# Altium project coilcube_frontend_v2.PrjPcb
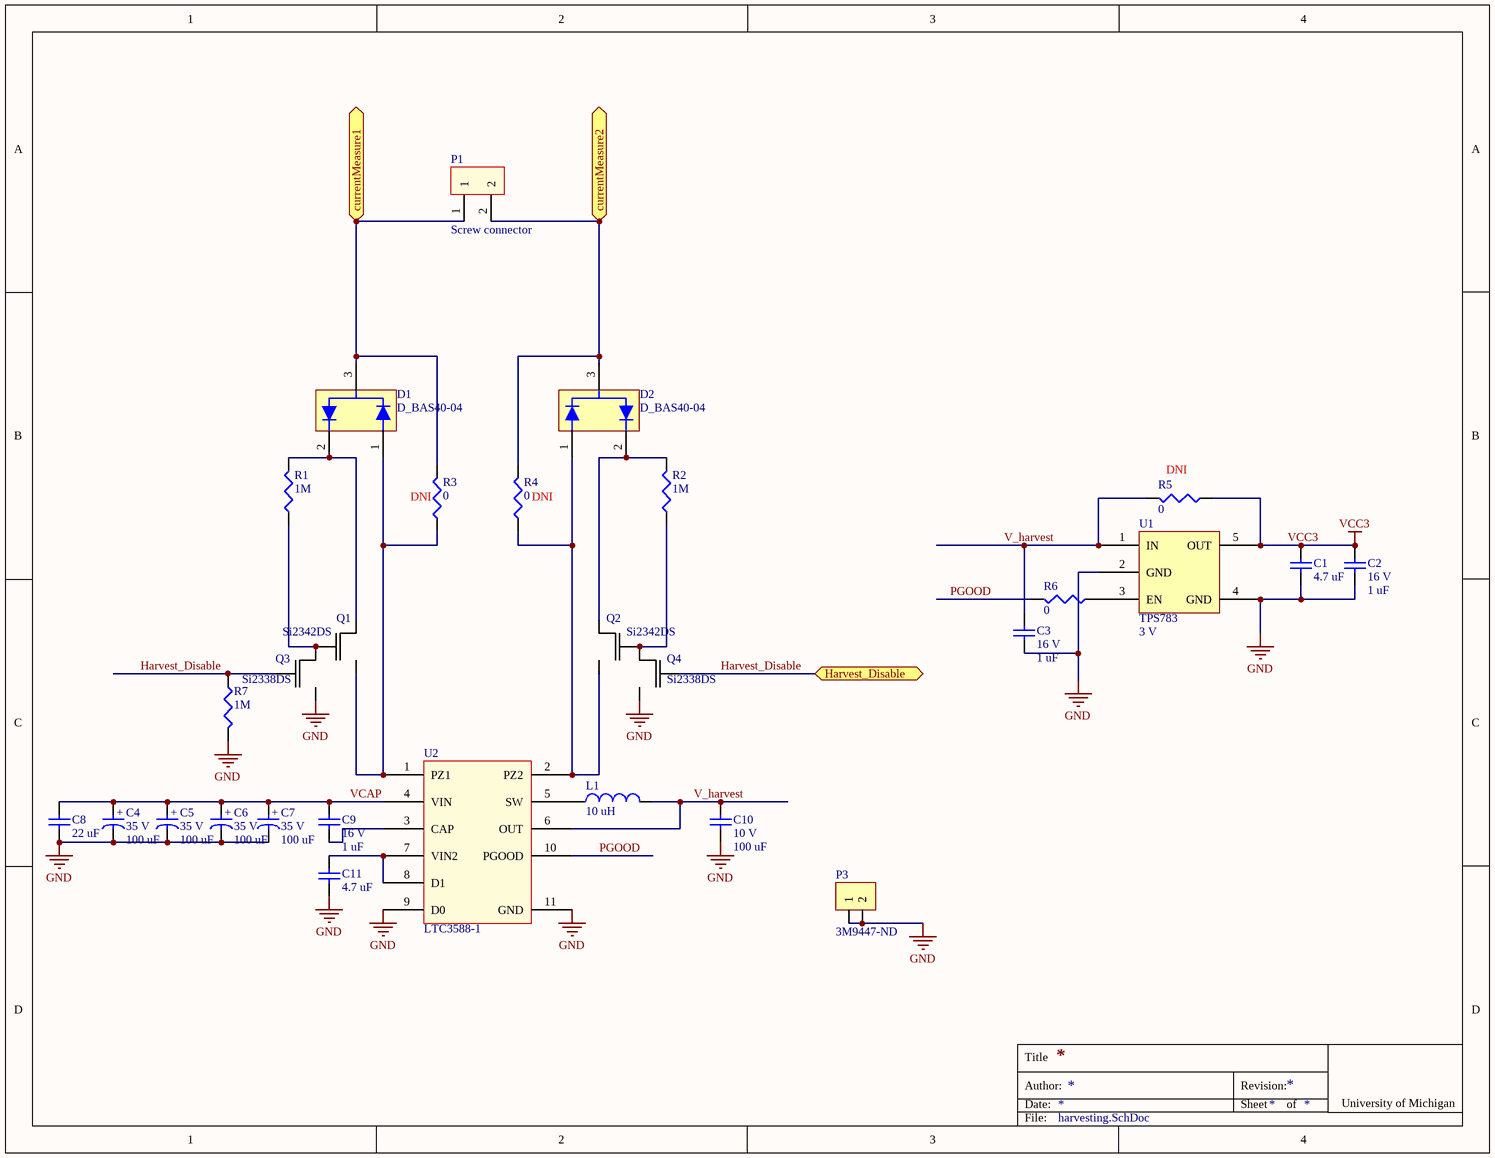
[diagram p0: harvesting.SchDoc]
3 sheets, 57 parts. Net scope: flat (ports and power ports of the same name join across sheets).
Board files: coilcube_frontend_v2.PcbDoc, coilcube_v5.PcbDoc
Sheets:
  harvesting.SchDoc
  IVSense.SchDoc
  proc.SchDoc

## Sheet harvesting.SchDoc
size Letter

### Parts
(Parts that share a designator on the sheet are numbered #1, #2 ... from top to bottom, then left to right.)
C1  value 4.7 uF  [0603]  (hidden comment: Ceramic capacitor)
C2  value 1 uF  voltage rated: 16 V  [0603]  (hidden comment: Ceramic capacitor)
C3  value 1 uF  voltage rated: 16 V  [0603]  (hidden comment: Ceramic capacitor)
C4  value 100 uF  voltage rated: 35 V  [KEMET_EDK_9H]  (hidden comment: Aluminum capacitor)
C5  value 100 uF  voltage rated: 35 V  [KEMET_EDK_9H]  (hidden comment: Aluminum capacitor)
C6  value 100 uF  voltage rated: 35 V  [KEMET_EDK_9H]  (hidden comment: Aluminum capacitor)
C7  value 100 uF  voltage rated: 35 V  [KEMET_EDK_9H]  (hidden comment: Aluminum capacitor)
C8  value 22 uF  [1206]  (hidden comment: Ceramic capacitor)
C9  value 1 uF  voltage rated: 16 V  [0603]  (hidden comment: Ceramic capacitor)
C10  value 100 uF  voltage rated: 10 V  [1210]  (hidden comment: Ceramic capacitor)
C11  value 4.7 uF  [0603]  (hidden comment: Ceramic capacitor)
D1  D_BAS40-04  [SOT23-3]
D2  D_BAS40-04  [SOT23-3]
L1  value 10 uH  [CDRH2D18]  (hidden comment: Chip inductor)
P1  Screw connector  [MPT_2position]
P3  Supplier Part Number 1: 3M9447-ND  [1x2 header]  (hidden comment: 1 x 2 header)
Q1#1  Si2342DS  [SOT23-3]
Q2#1  Si2342DS  [SOT23-3]
Q3  Si2338DS  [SOT23-3]
Q4  Si2338DS  [SOT23-3]
R1#1  value 1M  [0603]  (hidden comment: Chip resistor)
R2#1  value 1M  [0603]  (hidden comment: Chip resistor)
R3#1  value 0  [0603]  (hidden comment: Chip resistor)
R4#1  value 0  [0603]  (hidden comment: Chip resistor)
R5#1  value 0  [0603]  (hidden comment: Chip resistor)
R6#1  value 0  [0603]  (hidden comment: Chip resistor)
R7#1  value 1M  [0603]  (hidden comment: Chip resistor)
U1  TPS783  Output Voltage: 3 V  [SOT23-5]
U2  LTC3588-1  [TSSOP50P490X110_HS-11N]

### Ports
currentMeasure1, currentMeasure2, Harvest_Disable

### Nets
GND: C1.2 C2.2 C3.2 C4.2 C5.2 C6.2 C7.2 C8.2 C10.2 C11.2 P3.1 P3.2 Q3.2(S) Q4.2(S) R7#1.1 U1.2(GND) U1.4(GND) U2.9(D0) U2.11(GND)
VCC3: C1.1 C2.1 R5#1.2 U1.5(OUT)
Harvest_Disable: Q3.1(G) Q4.1(G) R7#1.2 ; port Harvest_Disable
PGOOD: R6#1.1 U2.10(PGOOD)
V_harvest: C3.1 C10.1 L1.1 R5#1.1 U1.1(IN) U2.6(OUT)
VCAP: C4.1 C5.1 C6.1 C7.1 C8.1 C9.1 U2.4(VIN)
NetC9_2: C9.2 U2.3(CAP)
NetC11_1: C11.1 U2.7(VIN2) U2.8(D1)
NetD1_1: D1.1 Q1#1.2(S) R3#1.2 U2.1(PZ1)
NetD1_2: D1.2 Q1#1.3(D) R1#1.1
NetD1_3: D1.3 P1.1 R3#1.1 ; port currentMeasure1
NetD2_1: D2.1 Q2#1.2(S) R4#1.2 U2.2(PZ2)
NetD2_2: D2.2 Q2#1.3(D) R2#1.1
NetD2_3: D2.3 P1.2 R4#1.1 ; port currentMeasure2
NetL1_2: L1.2 U2.5(SW)
NetQ1#1_1: Q1#1.1(G) Q3.3(D) R1#1.2
NetQ2#1_1: Q2#1.1(G) Q4.3(D) R2#1.2
NetR6#1_2: R6#1.2 U1.3(EN)

### Notes on the sheet
- (near R3#1) DNI
- (near R4#1) DNI
- (near R5#1) DNI
- Title
- Date:
- Author:
- Revision:
- Sheet
- of
- University of Michigan
- File:
- (in symbol C_100u_35V_aluminum) +

### Library data of the parts
C1 C11 = C_4.7u_10V_0603_ceramic: Ceramic capacitor, 4.7u, 10V, 0603 package; Manufacture: TDK; tolerance: 20%; Temp rating: X5R; package: 0603; voltage rated: 10 V; Supplier 1: Digi-Key; Supplier Part Number 1: 445-7482-1-ND
C2 C3 C9 = C_1u_16V_0603_ceramic: Ceramic capacitor, 1 uF, 16 V, 0603 package; Manufacture: TDK; tolerance: 10%; package: 0603; Supplier 1: Digi-Key; Supplier Part Number 1: 445-1604-1-ND
C4-C7 = C_100u_35V_aluminum: Aluminum capacitor, 100 uF, 35 V, KEMET EDK 9H; tolerance: 20%; Manufacture: Kemet; Supplier 1: Digi-Key; Supplier Part Number 1: 399-6671-1-ND
C8 = C_22u_35V_1206_ceramic: Ceramic capacitor, 22 uF, 35 V, 1206 package; Manufacture: TDK; voltage rated: 35 V; tolerance: 20%; package: 1206; Supplier 1: Digi-Key; Supplier Part Number 1: 445-8045-1-ND
C10 = C_100u_10V_1210_ceramic: Ceramic capacitor, 100u, 1210 package; Manufacture: Samsung; tolerance: 20%; package: 2917; Supplier 1: Digi-Key; Supplier Part Number 1: 1276-3364-1-ND
D1 D2 = D_BAS40-04: SURFACE MOUNT SCHOTTKY BARRIER DIODE; Supplier 1: Digi-Key; Supplier Part Number 1: BAS40-04FDICT-ND
L1 = L_10uH_1A_180m: Chip inductor, 10 uH,  1A, 180 mOhm; tolerance: 30%; Supplier 1: Digi-Key; Supplier Part Number 1: 308-1959-1-ND
P1 = MPT_2POS: Screw connector 2 positions; Supplier 1: Digi-Key; Supplier Part Number 1: 277-1273-ND
P3 = 1 x 2 header: 100 mils standard header; Supplier 1: Digi-Key
Q1#1 Q2#1 = Si2342DS: N-Channel 8 V (D-S) MOSFET; Supplier 1: Digi-Key; Supplier Part Number 1: SI2342DS-T1-GE3-ND
Q3 Q4 = Si2338DS: N-Channel 30 V (D-S) MOSFET; Supplier 1: Digi-Key; Supplier Part Number 1: SI2338DS-T1-GE3CT-ND
R1#1 R2#1 R7#1 = R_1M_0603: Chip resistor, 1 Meg, 0603 package; tolerance: 1%; power: 1/10 W; package: 0603; Supplier 1: Digi-Key; Supplier Part Number 1: 541-1.00MHCT-ND
R3#1 R4#1 R5#1 R6#1 = R_0_0603: Chip resistor, 0, 0603 package; package: 0603; Supplier 1: Digi-Key; Supplier Part Number 1: 541-0.0GCT-ND
U1 = TPS783: TPS783xx 500-nA IQ, 150-mA, Ultralow Quiescent Current  Low-Dropout Linear Regulator; Supplier 1: Digi-Key; Supplier Part Number 1: 296-25880-1-ND
U2 = LTC3588-1: Piezoelectric Energy   Harvesting Power Supply; Supplier 1: Digi-Key; Supplier Part Number 1: LTC3588EMSE-1#PBF-ND

## Sheet IVSense.SchDoc: Gemini++
size Letter; Author: Ye-Sheng Kuo; Revision: 7; SheetTotal: 4
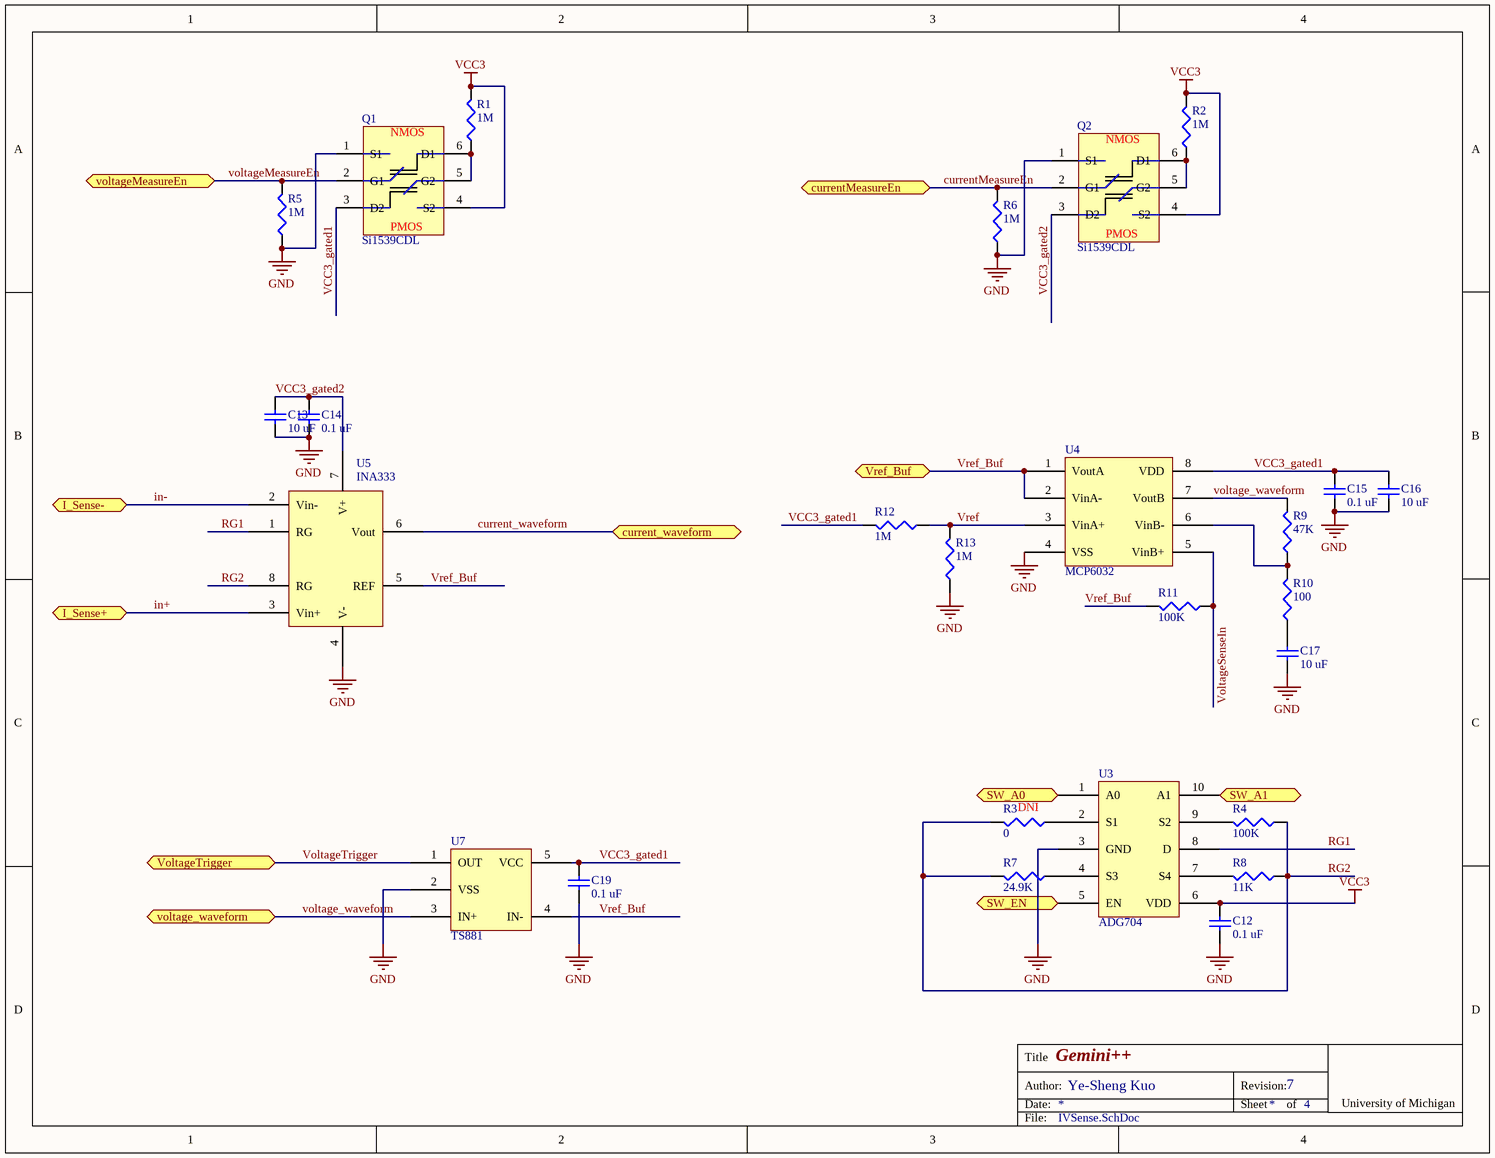
[diagram p1: IVSense.SchDoc]

### Parts
(Parts that share a designator on the sheet are numbered #1, #2 ... from top to bottom, then left to right.)
C12  value 0.1 uF  [0402]  (hidden comment: Ceramic capacitor)
C13  value 10 uF  [0603]  (hidden comment: Ceramic capacitor)
C14  value 0.1 uF  [0402]  (hidden comment: Ceramic capacitor)
C15  value 0.1 uF  [0402]  (hidden comment: Ceramic capacitor)
C16  value 10 uF  [0603]  (hidden comment: Ceramic capacitor)
C17  value 10 uF  [0603]  (hidden comment: Ceramic capacitor)
C19  value 0.1 uF  [0402]  (hidden comment: Ceramic capacitor)
Q1#2  Si1539CDL  [SC70-6]
Q2#2  Si1539CDL  [SC70-6]
R1#2  value 1M  [0402]  (hidden comment: Chip resistor)
R2#2  value 1M  [0402]  (hidden comment: Chip resistor)
R3#2  value 0  [0402]  (hidden comment: Chip resistor)
R4#2  value 100K  [0402]  (hidden comment: Chip resistor)
R5#2  value 1M  [0402]  (hidden comment: Chip resistor)
R6#2  value 1M  [0402]  (hidden comment: Chip resistor)
R7#2  value 24.9K  [0402]  (hidden comment: Chip resistor)
R8  value 11K  [0402]  (hidden comment: Chip resistor)
R9  value 47K  [0402]  (hidden comment: Chip resistor)
R10  value 100  [0402]  (hidden comment: Chip resistor)
R11  value 100K  [0402]  (hidden comment: Chip resistor)
R12  value 1M  [0402]  (hidden comment: Chip resistor)
R13  value 1M  [0402]  (hidden comment: Chip resistor)
U3  ADG704  [uSOIC-10]
U4  MCP6032  [MSOP-8]
U5  INA333  [MSOP-8]
U7#1  TS881  [SC70-5]

### Ports
current_waveform, currentMeasureEn, I_Sense+, I_Sense-, SW_A0, SW_A1, SW_EN, voltage_waveform, voltageMeasureEn, VoltageTrigger, Vref_Buf

### Nets
GND: C12.2 C13.2 C14.2 C15.2 C16.2 C17.2 C19.2 Q1#2.1(S1) Q2#2.1(S1) R5#2.2 R6#2.2 R13.2 U3.3(GND) U4.4(VSS) U5.4(V-) U7#1.2(VSS)
VCC3: C12.1 Q1#2.4(S2) Q2#2.4(S2) R1#2.1 R2#2.1 U3.6(VDD)
current_waveform: U5.6(Vout) ; port current_waveform
currentMeasureEn: Q2#2.2(G1) R6#2.1 ; port currentMeasureEn
in+: U5.3(Vin+) ; port I_Sense+
in-: U5.2(Vin-) ; port I_Sense-
RG1: U3.8(D) U5.1(RG)
RG2: R3#2.1 R4#2.2 R7#2.1 R8.2 U5.8(RG)
VCC3_gated1: C15.1 C16.1 C19.1 Q1#2.3(D2) R12.1 U4.8(VDD) U7#1.5(VCC)
VCC3_gated2: C13.1 C14.1 Q2#2.3(D2) U5.7(V+)
voltage_waveform: R9.1 U4.7(VoutB) U7#1.3(IN+) ; port voltage_waveform
voltageMeasureEn: Q1#2.2(G1) R5#2.1 ; port voltageMeasureEn
VoltageSenseIn: R11.2 U4.5(VinB+)
VoltageTrigger: U7#1.1(OUT) ; port VoltageTrigger
Vref: R12.2 R13.1 U4.3(VinA+)
Vref_Buf: R11.1 U4.1(VoutA) U4.2(VinA-) U5.5(REF) U7#1.4(IN-) ; port Vref_Buf
NetC17_1: C17.1 R10.2
NetQ1#2_5: Q1#2.5(G2) Q1#2.6(D1) R1#2.2
NetQ2#2_5: Q2#2.5(G2) Q2#2.6(D1) R2#2.2
NetR3#2_2: R3#2.2 U3.2(S1)
NetR4#2_1: R4#2.1 U3.9(S2)
NetR7#2_2: R7#2.2 U3.4(S3)
NetR8_1: R8.1 U3.7(S4)
NetR9_2: R9.2 R10.1 U4.6(VinB-)
NetU3_1: U3.1(A0) ; port SW_A0
NetU3_5: U3.5(EN) ; port SW_EN
NetU3_10: U3.10(A1) ; port SW_A1

### Notes on the sheet
- (near R3#2) DNI
- Title
- Date:
- Author:
- Revision:
- Sheet
- of
- University of Michigan
- File:
- (in symbol Si1539CDL) NMOS; PMOS

### Library data of the parts
C12 C14 C15 C19 = C_0.1u_10V_0402_ceramic: Ceramic capacitor, 0.1u, 0402 package; Manufacture: TDK; voltage rated: 10 V; tolerance: 10%; Supplier 1: Digi-Key; Supplier Part Number 1: 445-1265-1-ND; package: 0402
C13 C16 C17 = C_10u_6.3V_0603_ceramic: Ceramic capacitor, 10 uF, 0603 package; Manufacture: TDK; voltage rated: 6.3V; tolerance: 20%; package: 0603; Supplier 1: Digi-Key; Supplier Part Number 1: 445-4112-1-ND
Q1#2 Q2#2 = Si1539CDL: N- and P-Channel 30 V (D-S) MOSFET; Supplier 1: Digi-Key; Supplier Part Number 1: SI1539CDL-T1-GE3CT-ND
R1#2 R2#2 R5#2 R6#2 R12 R13 = R_1M_0402: Chip resistor, 1M, 0402 package; tolerance: 1%; power: 1/16 W; Supplier 1: Digi-Key; Supplier Part Number 1: 541-1.00MLCT-ND; package: 0402
R3#2 = R_0_0402: Chip resistor, 0, 0402 package; package: 0402; Supplier 1: Digi-Key; Supplier Part Number 1: 541-0.0YBCT-ND
R4#2 R11 = R_100K_0402: Chip resistor, 100K, 0402 package; tolerance: 1%; power: 1/16 W; Supplier 1: Digi-Key; Supplier Part Number 1: 541-100KLCT-ND; package: 0402
R7#2 = R_24.9K_0402: Chip resistor, 24.9K, 0402 package; tolerance: 1%; power: 1/16 W; package: 0402; Supplier 1: Digi-Key; Supplier Part Number 1: 541-24.9KLCT-ND
R8 = R_11K_0402: Chip resistor, 11K, 0603 package; tolerance: 1%; power: 1/16 W; package: 0402; Supplier 1: Digi-Key; Supplier Part Number 1: 541-11.0KLCT-ND
R9 = R_47K_0402: Chip resistor, 47K, 0402 package; tolerance: 1%; power: 1/16 W; package: 0402; Supplier 1: Digi-Key; Supplier Part Number 1: 541-47.0KLCT-ND
R10 = R_100_0402: Chip resistor, 100, 0402 package; tolerance: 1%; power: 1/16 W; package: 0402; Supplier 1: Digi-Key; Supplier Part Number 1: 541-100LCT-ND
U3 = ADG704: CMOS  Low Voltage 4 V, 4-Channel Multiplexer; Supplier 1: Digi-Key; Supplier Part Number 1: ADG704BRMZ-REELCT-ND
U4 = MCP6032: 0.9 µA, High Precision Op Amps; Supplier 1: Digi-Key; Supplier Part Number 1: MCP6032T-E/MSCT-ND
U5 = INA333: Micro-Power (50µA), Zerø-Drift, Rail-to-Rail Out  Instrumentation Amplifier; Supplier 1: Digi-Key; Supplier Part Number 1: 296-23564-1-ND
U7#1 = TS881: Rail-to-rail 0.9 V nanopower comparator; Supplier 1: Digi-Key; Supplier Part Number 1: 497-13217-1-ND

## Sheet proc.SchDoc
size Letter
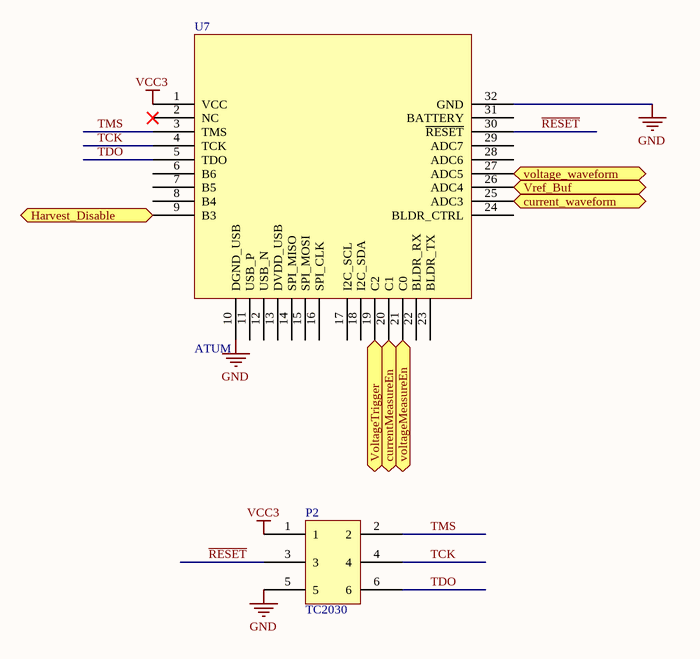
[diagram p2: proc.SchDoc]

### Parts
(Parts that share a designator on the sheet are numbered #1, #2 ... from top to bottom, then left to right.)
P2  TC2030  [TC2030-IDC-NLFP]
U7#2  ATUM  [ATUM]

### Ports
current_waveform, currentMeasureEn, Harvest_Disable, voltage_waveform, voltageMeasureEn, VoltageTrigger, Vref_Buf

### Nets
GND: P2.5 U7#2.10(DGND_USB) U7#2.32(GND)
VCC3: P2.1 U7#2.1(VCC)
current_waveform: U7#2.25(ADC3) ; port current_waveform
currentMeasureEn: U7#2.20(C1) ; port currentMeasureEn
Harvest_Disable: U7#2.9(B3) ; port Harvest_Disable
~{RESET}: P2.3 U7#2.30(~{RESET})
TCK: P2.4 U7#2.4(TCK)
TDO: P2.6 U7#2.5(TDO)
TMS: P2.2 U7#2.3(TMS)
voltage_waveform: U7#2.27(ADC5) ; port voltage_waveform
voltageMeasureEn: U7#2.21(C0) ; port voltageMeasureEn
VoltageTrigger: U7#2.19(C2) ; port VoltageTrigger
Vref_Buf: U7#2.26(ADC4) ; port Vref_Buf

Not connected (* = marked no-connect by the designer): U7#2 2(NC)* 6(B6) 7(B5) 8(B4) 11(USB_P) 12(USB_N) 13(DVDD_USB) 14(SPI_MISO) 15(SPI_MOSI) 16(SPI_CLK) 17(I2C_SCL) 18(I2C_SDA) 22(BLDR_RX) 23(BLDR_TX) 24(BLDR_CTRL) 28(ADC6) 29(ADC7) 31(BATTERY)

### Notes on the sheet
- Title
- Date:
- Author:
- Revision:
- Sheet
- of
- University of Michigan
- File:

### Library data of the parts
P2 = TC2030: TC2030-MCP-NL

## Nets that join several sheets
GND: harvesting (19 pins), IVSense (16 pins), proc (P2.5 U7#2.10 U7#2.32)
VCC3: harvesting (C1.1 C2.1 R5#1.2 U1.5), IVSense (6 pins), proc (P2.1 U7#2.1)
current_waveform: IVSense (U5.6), proc (U7#2.25)
currentMeasureEn: IVSense (Q2#2.2 R6#2.1), proc (U7#2.20)
Harvest_Disable: harvesting (Q3.1 Q4.1 R7#1.2), proc (U7#2.9)
voltage_waveform: IVSense (R9.1 U4.7 U7#1.3), proc (U7#2.27)
voltageMeasureEn: IVSense (Q1#2.2 R5#2.1), proc (U7#2.21)
VoltageTrigger: IVSense (U7#1.1), proc (U7#2.19)
Vref_Buf: IVSense (5 pins), proc (U7#2.26)